# Altium schematic sheet schematic.SchDoc
size A4; Organization: Altium Limited; Address1: L3, 12a Rodborough Rd; Address2: Frenchs Forest; Address3: NSW; Address4: Australia 2086
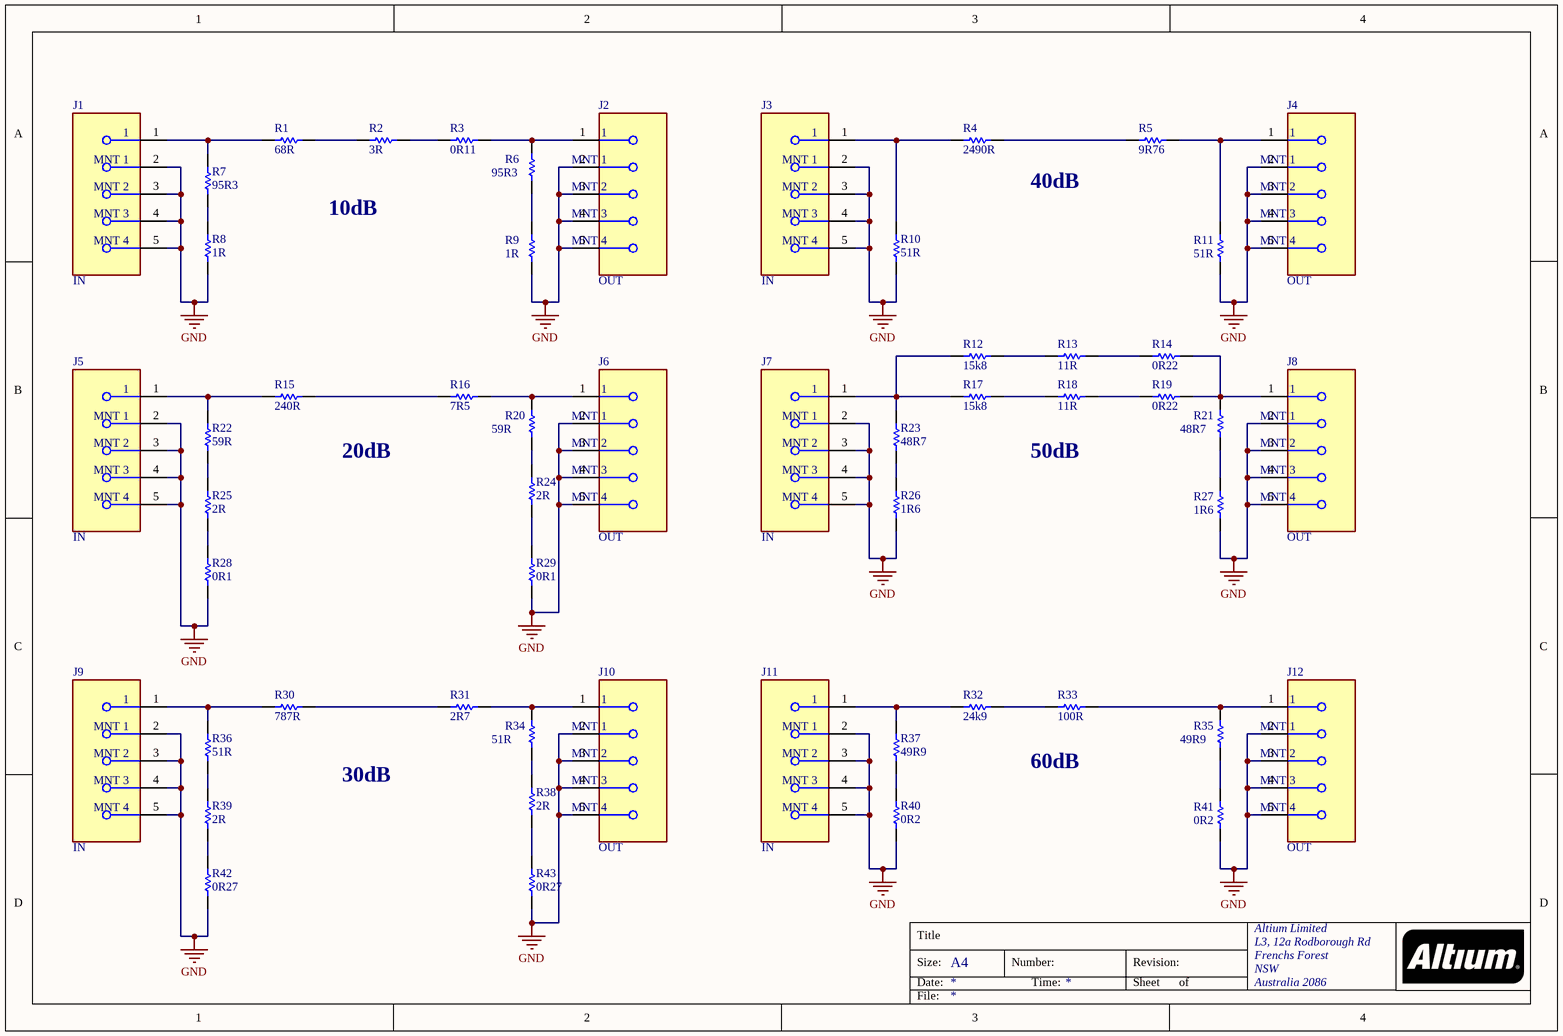
[diagram p0: schematic.SchDoc]

## Parts
J1  IN  [FP-CON-SMA-EDGE-S-MFG]
J2  OUT  [FP-CON-SMA-EDGE-S-MFG]
J3  IN  [FP-CON-SMA-EDGE-S-MFG]
J4  OUT  [FP-CON-SMA-EDGE-S-MFG]
J5  IN  [FP-CON-SMA-EDGE-S-MFG]
J6  OUT  [FP-CON-SMA-EDGE-S-MFG]
J7  IN  [FP-CON-SMA-EDGE-S-MFG]
J8  OUT  [FP-CON-SMA-EDGE-S-MFG]
J9  IN  [FP-CON-SMA-EDGE-S-MFG]
J10  OUT  [FP-CON-SMA-EDGE-S-MFG]
J11  IN  [FP-CON-SMA-EDGE-S-MFG]
J12  OUT  [FP-CON-SMA-EDGE-S-MFG]
R1  68R  [RESC3225X70X50NL20T20]
R2  3R  [RESC3225X70X50NL20T20]
R3  0R11  [RESC3225X70X50NL20T20]
R4  2490R  [RESC3225X70X50NL20T20]
R5  9R76  [RESC3225X70X50NL20T20]
R6  95R3  [RESC3225X70X50NL20T20]
R7  95R3  [RESC3225X70X50NL20T20]
R8  1R  [RESC3225X70X50NL20T20]
R9  1R  [RESC3225X70X50NL20T20]
R10  51R  [RESC3225X70X50NL20T20]
R11  51R  [RESC3225X70X50NL20T20]
R12  15k8  [RESC3225X70X50NL20T20]
R13  11R  [RESC3225X70X50NL20T20]
R14  0R22  [RESC3225X70X50NL20T20]
R15  240R  [RESC3225X70X50NL20T20]
R16  7R5  [RESC3225X70X50NL20T20]
R17  15k8  [RESC3225X70X50NL20T20]
R18  11R  [RESC3225X70X50NL20T20]
R19  0R22  [RESC3225X70X50NL20T20]
R20  59R  [RESC3225X70X50NL20T20]
R21  48R7  [RESC3225X70X50NL20T20]
R22  59R  [RESC3225X70X50NL20T20]
R23  48R7  [RESC3225X70X50NL20T20]
R24  2R  [RESC3225X70X50NL20T20]
R25  2R  [RESC3225X70X50NL20T20]
R26  1R6  [RESC3225X70X50NL20T20]
R27  1R6  [RESC3225X70X50NL20T20]
R28  0R1  [RESC3225X70X50NL20T20]
R29  0R1  [RESC3225X70X50NL20T20]
R30  787R  [RESC3225X70X50NL20T20]
R31  2R7  [RESC3225X70X50NL20T20]
R32  24k9  [RESC3225X70X50NL20T20]
R33  100R  [RESC3225X70X50NL20T20]
R34  51R  [RESC3225X70X50NL20T20]
R35  49R9  [RESC3225X70X50NL20T20]
R36  51R  [RESC3225X70X50NL20T20]
R37  49R9  [RESC3225X70X50NL20T20]
R38  2R  [RESC3225X70X50NL20T20]
R39  2R  [RESC3225X70X50NL20T20]
R40  0R2  [RESC3225X70X50NL20T20]
R41  0R2  [RESC3225X70X50NL20T20]
R42  0R27  [RESC3225X70X50NL20T20]
R43  0R27  [RESC3225X70X50NL20T20]

## Nets
GND: J1.2(MNT_1) J1.3(MNT_2) J1.4(MNT_3) J1.5(MNT_4) J2.2(MNT_1) J2.3(MNT_2) J2.4(MNT_3) J2.5(MNT_4) J3.2(MNT_1) J3.3(MNT_2) J3.4(MNT_3) J3.5(MNT_4) J4.2(MNT_1) J4.3(MNT_2) J4.4(MNT_3) J4.5(MNT_4) J5.2(MNT_1) J5.3(MNT_2) J5.4(MNT_3) J5.5(MNT_4) J6.2(MNT_1) J6.3(MNT_2) J6.4(MNT_3) J6.5(MNT_4) J7.2(MNT_1) J7.3(MNT_2) J7.4(MNT_3) J7.5(MNT_4) J8.2(MNT_1) J8.3(MNT_2) J8.4(MNT_3) J8.5(MNT_4) J9.2(MNT_1) J9.3(MNT_2) J9.4(MNT_3) J9.5(MNT_4) J10.2(MNT_1) J10.3(MNT_2) J10.4(MNT_3) J10.5(MNT_4) J11.2(MNT_1) J11.3(MNT_2) J11.4(MNT_3) J11.5(MNT_4) J12.2(MNT_1) J12.3(MNT_2) J12.4(MNT_3) J12.5(MNT_4) R8.1 R9.1 R10.1 R11.1 R26.1 R27.1 R28.1 R29.1 R40.1 R41.1 R42.1 R43.1
NetJ1_1: J1.1 R1.1 R7.2
NetJ2_1: J2.1 R3.2 R6.2
NetJ3_1: J3.1 R4.1 R10.2
NetJ4_1: J4.1 R5.2 R11.2
NetJ5_1: J5.1 R15.1 R22.2
NetJ6_1: J6.1 R16.2 R20.2
NetJ7_1: J7.1 R12.1 R17.1 R23.2
NetJ8_1: J8.1 R14.2 R19.2 R21.2
NetJ9_1: J9.1 R30.1 R36.2
NetJ10_1: J10.1 R31.2 R34.2
NetJ11_1: J11.1 R32.1 R37.2
NetJ12_1: J12.1 R33.2 R35.2
NetR1_2: R1.2 R2.1
NetR2_2: R2.2 R3.1
NetR4_2: R4.2 R5.1
NetR6_1: R6.1 R9.2
NetR7_1: R7.1 R8.2
NetR12_2: R12.2 R13.1
NetR13_2: R13.2 R14.1
NetR15_2: R15.2 R16.1
NetR17_2: R17.2 R18.1
NetR18_2: R18.2 R19.1
NetR20_1: R20.1 R24.2
NetR21_1: R21.1 R27.2
NetR22_1: R22.1 R25.2
NetR23_1: R23.1 R26.2
NetR24_1: R24.1 R29.2
NetR25_1: R25.1 R28.2
NetR30_2: R30.2 R31.1
NetR32_2: R32.2 R33.1
NetR34_1: R34.1 R38.2
NetR35_1: R35.1 R41.2
NetR36_1: R36.1 R39.2
NetR37_1: R37.1 R40.2
NetR38_1: R38.1 R43.2
NetR39_1: R39.1 R42.2

## Notes on the sheet
- 40dB
- 10dB
- 20dB
- 50dB
- 30dB
- 60dB
- Title
- Size:
- Date:
- A4
- Number:
- Time:
- Revision:
- Sheet
- of
- File:

## Library data of the parts
J1-J12 = CMP-204357-000001-1: CONN SMA JACK STR EDGE MNT; Manufacturer Part Number: CON-SMA-EDGE-S; Manufacturer: RF Solutions Ltd.; Impedance: 50Ω; Conn Orientation: Right Angle; Is Female: yes; Number Of Contacts: 1; Frequency: 18GHz; Shielding: true; Category: Conn; ComponentLink2URL: https://www.rfsolutions.co.uk/downloads/1498648656DS-CON-EDGE-SMA-4.pdf; Octopart: https://octopart.com/con-sma-edge-s-rf+solutions-70967450; Package: CONN_JACK; Height: 6.35mm; Device Class L1: Connectors; Footprint Url: https://forum.upverter.com/uploads/default/original/3X/b/e/be75b907af57498775929d6d9099689c472e0307.pdf; Contact Material: Gold; ComponentLink2Description: Datasheet; Device Class L2: RF / Coaxial Connectors; RoHS: TRUE; Device Class L3: unset; Digikey Description: CONN SMA JACK STR EDGE MNT; Lead Free: Yes; Automotive: No
R1-R43 = CMP-2005-01957-1: Manufacturer: Panasonic; Part Number: ERJ-14NF1001U